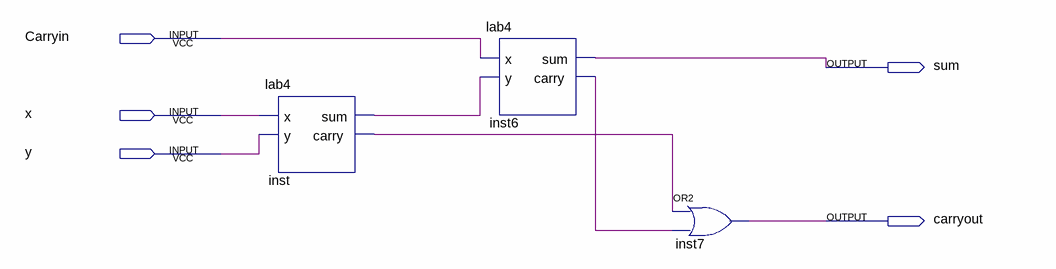
[diagram p0: schematic sheet]
// Quartus schematic Block3.bdf as structural Verilog: 3 symbols, 5 pins
module Block3 (
  input  Carryin,
  input  x,
  input  y,
  output sum,
  output carryout
);

  wire inst6_carry, inst_carry, inst_sum;

  lab4 inst (.x(x), .y(y), .sum(inst_sum), .carry(inst_carry));
  lab4 inst6 (.x(Carryin), .y(inst_sum), .sum(sum), .carry(inst6_carry));
  or inst7 (carryout, inst_carry, inst6_carry);
endmodule
